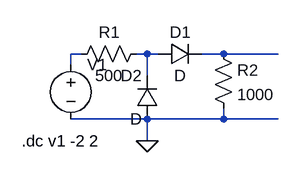
[diagram p0: schematic tut2 Q1.asc]
tut2 Q1.asc, the LTspice schematic file:
Version 4
SHEET 1 880 680
WIRE 32 112 16 112
WIRE 128 112 112 112
WIRE 144 112 128 112
WIRE 240 112 208 112
WIRE 320 112 240 112
WIRE 16 128 16 112
WIRE 128 144 128 112
WIRE 128 208 16 208
WIRE 240 208 240 192
WIRE 240 208 128 208
WIRE 320 208 240 208
WIRE 128 240 128 208
FLAG 128 240 0
SYMBOL res 128 96 R90
WINDOW 0 0 56 VBottom 2
WINDOW 3 32 56 VTop 2
SYMATTR InstName R1
SYMATTR Value 500
SYMBOL diode 144 128 R270
WINDOW 0 32 32 VTop 2
WINDOW 3 0 32 VBottom 2
SYMATTR InstName D1
SYMBOL res 224 96 R0
SYMATTR InstName R2
SYMATTR Value 1000
SYMBOL diode 144 208 R180
WINDOW 0 24 64 Left 2
WINDOW 3 24 0 Left 2
SYMATTR InstName D2
SYMBOL voltage 16 112 R0
WINDOW 123 0 0 Left 2
WINDOW 39 0 0 Left 2
SYMATTR InstName V1
SYMATTR Value ""
TEXT -56 240 Left 2 !.dc v1 -2 2

The netlist it stands for:
* tut2 Q1.asc
R1 N002 N001 500
D1 N002 N003 D
R2 N003 0 1000
D2 0 N002 D
V1 N001 0
.model D D
.lib standard.dio
.dc v1 -2 2
.backanno
.end